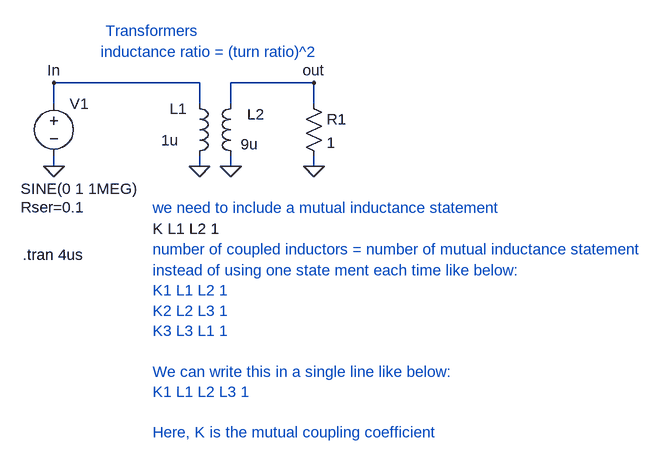
[diagram p0: schematic transformers.asc]
transformers.asc, the LTspice schematic file:
Version 4.1
SHEET 1 932 680
WIRE 176 96 -48 96
WIRE 352 96 224 96
WIRE -48 128 -48 96
WIRE 176 128 176 96
WIRE 224 128 224 96
WIRE 352 128 352 96
WIRE -48 224 -48 208
WIRE 176 224 176 208
WIRE 224 224 224 208
WIRE 352 224 352 208
FLAG 176 224 0
FLAG 224 224 0
FLAG 352 224 0
FLAG -48 224 0
FLAG -48 96 In
FLAG 352 96 out
SYMBOL ind 160 224 M180
WINDOW 0 -30 88 Left 2
WINDOW 3 -43 40 Left 2
SYMATTR InstName L1
SYMATTR Value 1u
SYMATTR Type ind
SYMBOL ind 240 224 R180
WINDOW 0 -36 80 Left 2
WINDOW 3 -26 34 Left 2
SYMATTR InstName L2
SYMATTR Value 9u
SYMATTR Type ind
SYMBOL voltage -48 112 R0
WINDOW 3 -51 147 Left 2
WINDOW 123 0 0 Left 0
WINDOW 39 -51 175 Left 2
SYMATTR InstName V1
SYMATTR Value SINE(0 1 1MEG)
SYMATTR SpiceLine Rser=0.1
SYMBOL res 336 112 R0
SYMATTR InstName R1
SYMATTR Value 1
TEXT 24 48 Left 2 ;inductance ratio = (turn ratio)^2
TEXT 32 16 Left 2 ;Transformers
TEXT 104 288 Left 2 ;we need to include a mutual inductance statement
TEXT 104 320 Left 2 !K L1 L2 1
TEXT 104 352 Left 2 ;number of coupled inductors = number of mutual inductance statement
TEXT 104 384 Left 2 ;instead of using one state ment each time like below:\nK1 L1 L2 1\nK2 L2 L3 1\nK3 L3 L1 1\n \nWe can write this in a single line like below:\nK1 L1 L2 L3 1\n \nHere, K is the mutual coupling coefficient
TEXT -96 360 Left 2 !.tran 4us

The netlist it stands for:
* transformers.asc
L1 0 In 1u
L2 0 out 9u
V1 In 0 SINE(0 1 1MEG) Rser=0.1
R1 out 0 1
* inductance ratio = (turn ratio)^2
* Transformers
* we need to include a mutual inductance statement
K L1 L2 1
* number of coupled inductors = number of mutual inductance statement
* instead of using one state ment each time like below:
* K1 L1 L2 1
* K2 L2 L3 1
* K3 L3 L1 1
* We can write this in a single line like below:
* K1 L1 L2 L3 1
* Here, K is the mutual coupling coefficient
.tran 4us
.backanno
.end

* Results of the author's LTspice run, read from the files saved beside the schematic
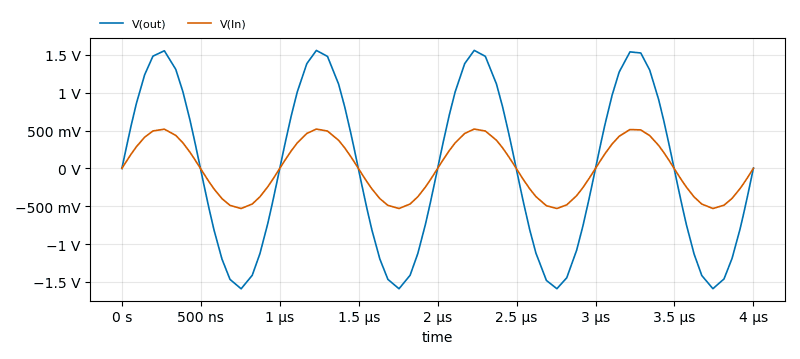
[diagram p1: Transient Analysis of transformers.asc, plotted from the saved traces]
* Transient Analysis, 1 run:
*   V(out): min -1.59 V, max 1.558 V, average -12.13 mV, rms 1.108 V, last 2.51 mV
*   V(In): min -530 mV, max 519.4 mV, average -4.044 mV, rms 369.4 mV, last 836.9 µV